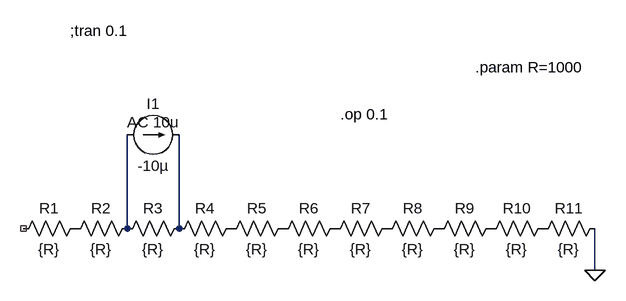
[diagram p0: schematic BV_nerve_simple.asc]
BV_nerve_simple.asc, the LTspice schematic file:
Version 4
SHEET 1 900 680
WIRE 160 128 160 -16
WIRE 240 128 240 -16
WIRE 880 192 880 128
FLAG 880 192 0
DATAFLAG 0 128 ""
SYMBOL res 96 112 R90
WINDOW 0 0 56 VBottom 2
WINDOW 3 32 56 VTop 2
SYMATTR InstName R1
SYMATTR Value {R}
SYMBOL res 176 112 R90
WINDOW 0 0 56 VBottom 2
WINDOW 3 32 56 VTop 2
SYMATTR InstName R2
SYMATTR Value {R}
SYMBOL res 256 112 R90
WINDOW 0 0 56 VBottom 2
WINDOW 3 32 56 VTop 2
SYMATTR InstName R3
SYMATTR Value {R}
SYMBOL res 336 112 R90
WINDOW 0 0 56 VBottom 2
WINDOW 3 32 56 VTop 2
SYMATTR InstName R4
SYMATTR Value {R}
SYMBOL res 416 112 R90
WINDOW 0 0 56 VBottom 2
WINDOW 3 32 56 VTop 2
SYMATTR InstName R5
SYMATTR Value {R}
SYMBOL res 496 112 R90
WINDOW 0 0 56 VBottom 2
WINDOW 3 32 56 VTop 2
SYMATTR InstName R6
SYMATTR Value {R}
SYMBOL res 576 112 R90
WINDOW 0 0 56 VBottom 2
WINDOW 3 32 56 VTop 2
SYMATTR InstName R7
SYMATTR Value {R}
SYMBOL res 656 112 R90
WINDOW 0 0 56 VBottom 2
WINDOW 3 32 56 VTop 2
SYMATTR InstName R8
SYMATTR Value {R}
SYMBOL res 736 112 R90
WINDOW 0 0 56 VBottom 2
WINDOW 3 32 56 VTop 2
SYMATTR InstName R9
SYMATTR Value {R}
SYMBOL res 816 112 R90
WINDOW 0 0 56 VBottom 2
WINDOW 3 32 56 VTop 2
SYMATTR InstName R10
SYMATTR Value {R}
SYMBOL res 896 112 R90
WINDOW 0 0 56 VBottom 2
WINDOW 3 32 56 VTop 2
SYMATTR InstName R11
SYMATTR Value {R}
SYMBOL current 160 -16 R270
WINDOW 0 32 40 VTop 2
WINDOW 3 -32 40 VBottom 2
WINDOW 123 4 40 VTop 2
WINDOW 39 0 0 Left 2
SYMATTR InstName I1
SYMATTR Value -10µ
SYMATTR Value2 AC 10u
TEXT 488 -48 Left 2 !.op 0.1
TEXT 696 -120 Left 2 !.param R=1000
TEXT 72 -176 Left 2 !;tran 0.1

The netlist it stands for:
* BV_nerve_simple.asc
R1 P001 NC_01 {R}
R2 N001 P001 {R}
R3 N002 N001 {R}
R4 P002 N002 {R}
R5 P003 P002 {R}
R6 P004 P003 {R}
R7 P005 P004 {R}
R8 P006 P005 {R}
R9 P007 P006 {R}
R10 P008 P007 {R}
R11 0 P008 {R}
I1 N001 N002 -10µ AC 10u
.op 0.1
.param R=1000
;tran 0.1
.backanno
.end